# EAGLE design hall-lamp (EAGLE 9.4.0)
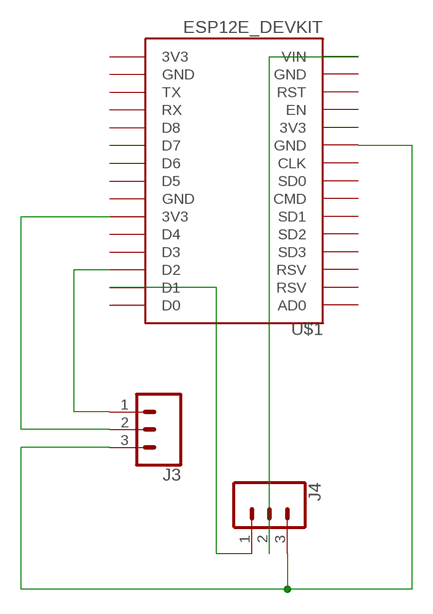
[diagram p0: schematic, sheet 1]

## Parts
J3  CONN_03  [1X03]
J4  CONN_03  [1X03]
U$1  ESP12E_DEVKIT  [ESP12E_DEVKIT]

## Nets
N$1: J3.3 J4.3 U$1.GND@0(GND)
N$7: J3.1 U$1.D2
N$8: J3.2 U$1.3V3@1(3V3)
N$10: J4.1 U$1.D1
N$11: J4.2 U$1.VIN
Unconnected: U$1.3V3@0(3V3) U$1.3V3@2(3V3) U$1.AD0 U$1.CLK U$1.CMD U$1.D0 U$1.D3 U$1.D4 U$1.D5 U$1.D6 U$1.D7 U$1.D8 U$1.EN U$1.GND@1(GND) U$1.GND@2(GND) U$1.GND@3(GND) U$1.RST U$1.RSV@0(RSV) U$1.RSV@1(RSV) U$1.RX U$1.SD0 U$1.SD1 U$1.SD2 U$1.SD3 U$1.TX

## Library data of the parts
J3 J4 = SparkFun-Connectors:CONN_03: Multi connection point. Often used as Generic Header-pin footprint for 0.1 inch spaced/style header connections On any of the 0.1 inch spaced packages, you can populate with these: Break Away Headers - Straight <https://www.sparkfun.com/products/116> (PRT-00116) Break Away Male Headers - Right Angle <https://www.sparkfun.com/products/553> (PRT-00553) Female Headers <https://www.sparkfun.com/products/115> (PRT-00115) Break Away Headers - Machine Pin <https://www.sparkfun.com/products/117> (PRT-00117) Break Away Female Headers - Swiss Machine Pin <https://www.sparkfun.com/products/743> (PRT-00743) Stackable Header - 3 Pin (Female, 0.1") <https://www.sparkfun.com/products/13875> (PRT-13875) For SCREWTERMINALS and SPRING TERMINALS visit here: Screw Terimnals on SparkFun.com <https://www.sparkfun.com/search/results?term=Screw+Terminals> (5mm/3.5mm/2.54mm spacing) This device is also useful as a general connection point to wire up your design to another part of your project. Our various solder wires solder well into these plated through hole pads. Hook-Up Wire - Assortment (Stranded, 22 AWG) <https://www.sparkfun.com/products/11375> (PRT-11375) Hook-Up Wire - Assortment (Solid Core, 22 AWG) <https://www.sparkfun.com/products/11367> (PRT-11367) View the entire wire category on our website here <https://www.sparkfun.com/categories/141> Special notes: Molex polarized connector foot print use with SKU : PRT-08232 with associated crimp pins and housings.
U$1 = ESP12E_DEVKIT:ESP12E_DEVKIT: ESP12E DEVKIT BOARD

## Board
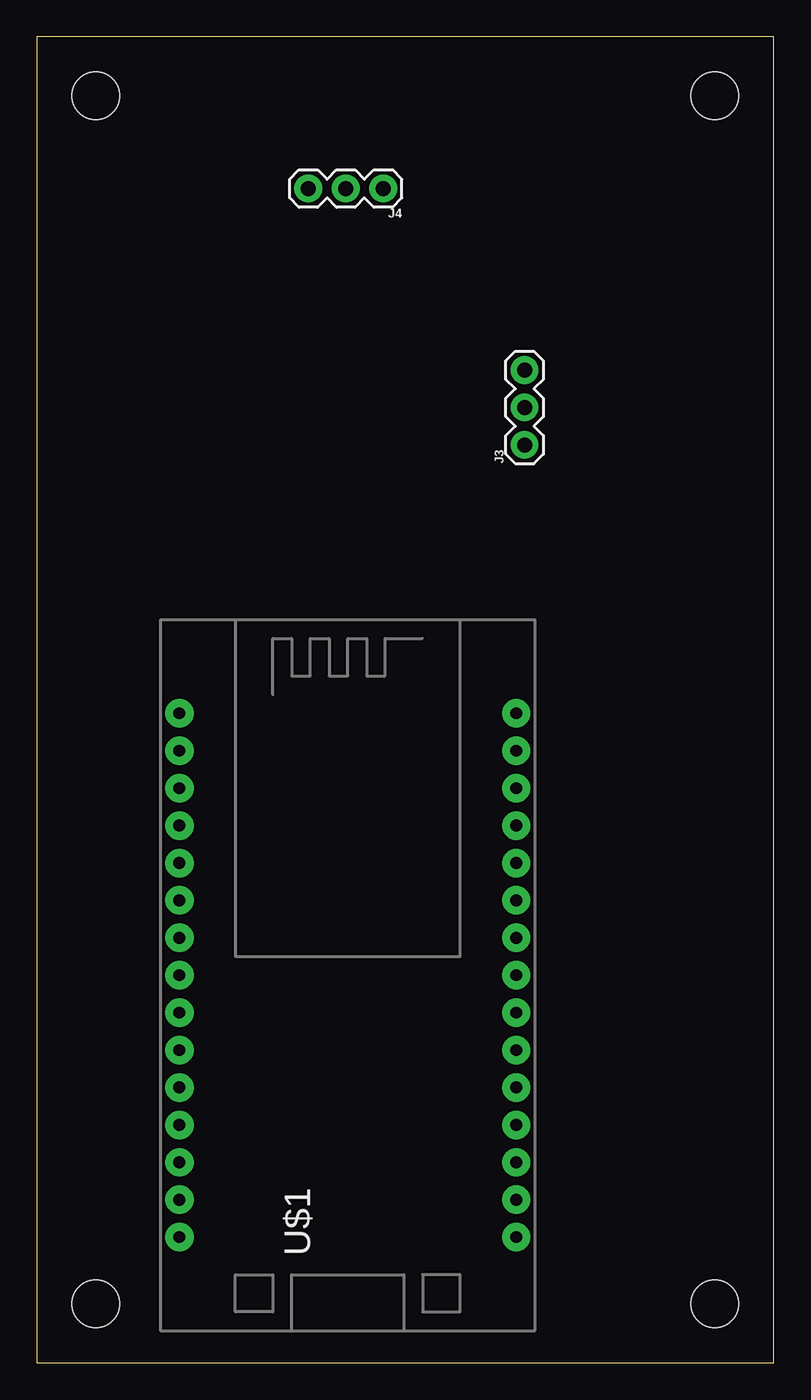
[diagram p1: board, top side]
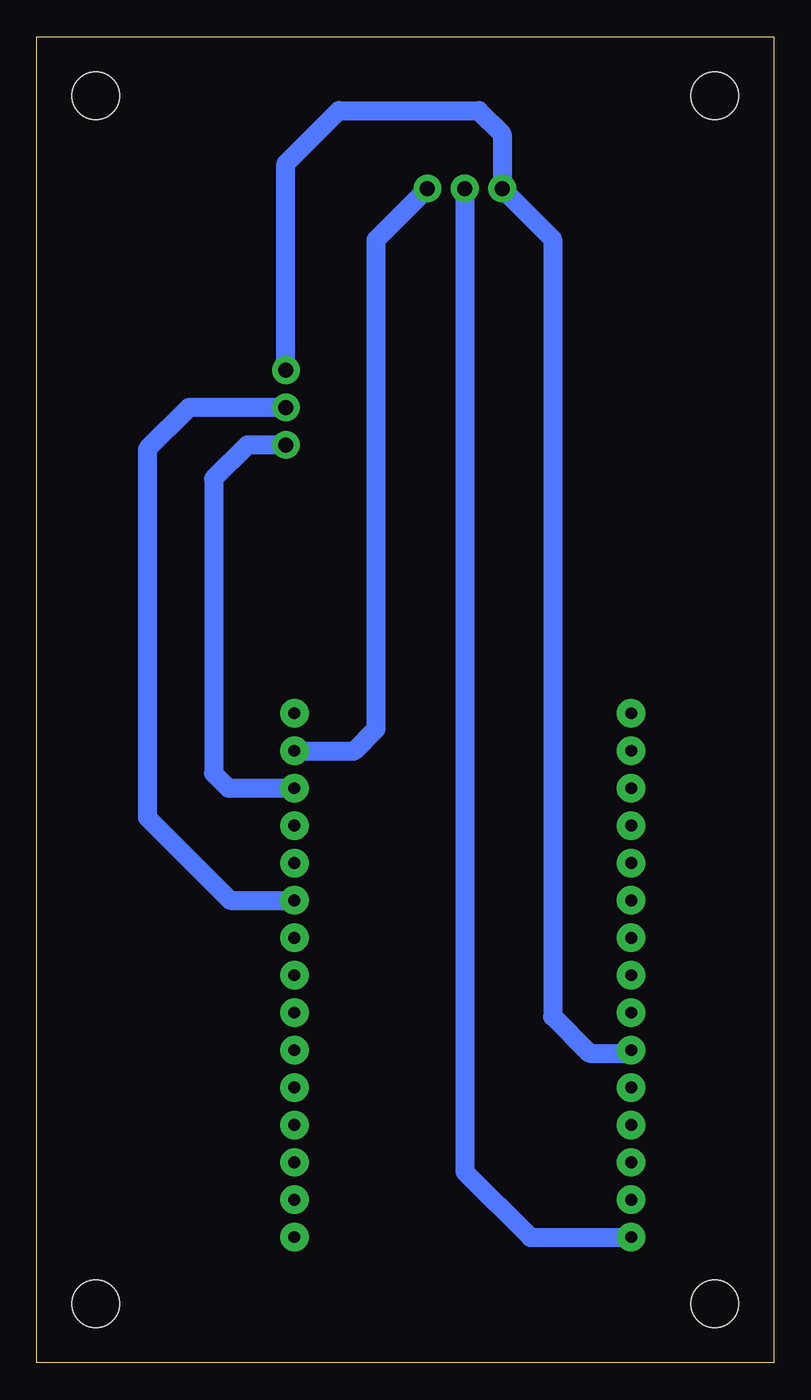
[diagram p2: board, bottom side, seen from below]

Size 50 x 90 mm. Coordinates in mm from the lower left corner, seen from the top.
Outline: 0,0 50,0 50,90 0,90 0,0
Copper layers (1*16): Top 0.035mm / dielectric 1.5mm / Bottom 0.035mm
Design rules "default": minimum track width 6mil, minimum drill 0.35mm, track to track 6mil, track to pad 6mil, pad to pad 6mil, via to via 6mil, smd to smd 6mil, copper to edge 40mil, drill to drill 6mil, minimum pad ring 10mil, minimum via ring 8mil, stop-mask expansion 4mil, vias tented up to drill 0mil, thermal gap 10mil
Holes 3.2 mm at 4,4 46,4 46,86 4,86

### Footprints (pad centres in the part's own frame; a part is rotated, then mirrored left to right if it is on the bottom)
1X03 = drill 1.016 pad 1.88: 1 0,0; 2 2.54,0; 3 5.08,0
ESP12E_DEVKIT = drill 0.8 pad 1.93: 3V3@0 -11.43,-7.62; 3V3@1 11.43,5.08; 3V3@2 11.43,-17.78; AD0 -11.43,17.78; CLK -11.43,-2.54; CMD -11.43,2.54; D0 11.43,17.78; D1 11.43,15.24; D2 11.43,12.7; D3 11.43,10.16; D4 11.43,7.62; D5 11.43,0; D6 11.43,-2.54; D7 11.43,-5.08; D8 11.43,-7.62; EN -11.43,-10.16; GND@0 -11.43,-5.08; GND@1 -11.43,-15.24; GND@2 11.43,2.54; GND@3 11.43,-15.24; RST -11.43,-12.7; RSV@0 -11.43,15.24; RSV@1 -11.43,12.7; RX 11.43,-10.16; SD0 -11.43,0; SD1 -11.43,5.08; SD2 -11.43,7.62; SD3 -11.43,10.16; TX 11.43,-12.7; VIN -11.43,-17.78

### Placement (x,y rotation side)
J3  33.1,62.3 90 top
J4  23.5,79.7 180 top
U$1  21.1,26.3 0 top

### Tracks (layer width: path | path; a pad name or v marks a point on that pad's centre or on a via)
N$1
  Bottom 1.3: U$1.GND@0 9.89,21 12.5,21 15,23.5 15,76.28 J4.3 18.42,83.42 20,85 29.5,85 33.1,81.4 J3.3
N$7
  Bottom 1.3: J3.1 35.7,62.3 38,60 38,40 37,39 U$1.D2
N$8
  Bottom 1.3: J3.2 39.66,64.84 42.5,62 42.5,37 36.88,31.38 U$1.3V3@1
N$10
  Bottom 1.3: J4.1 27,76.2 27,43 28.5,41.5 32.49,41.5 U$1.D1
N$11
  Bottom 1.3: J4.2 20.96,12.96 16.5,8.5 9.69,8.5 U$1.VIN